# Altium schematic sheet Cell_121_sheet_3.SchDoc
size 420 x 297 mm; DocumentNumber: Фг3.089.121 Э3; SheetNumber: 3; SheetTotal: 4
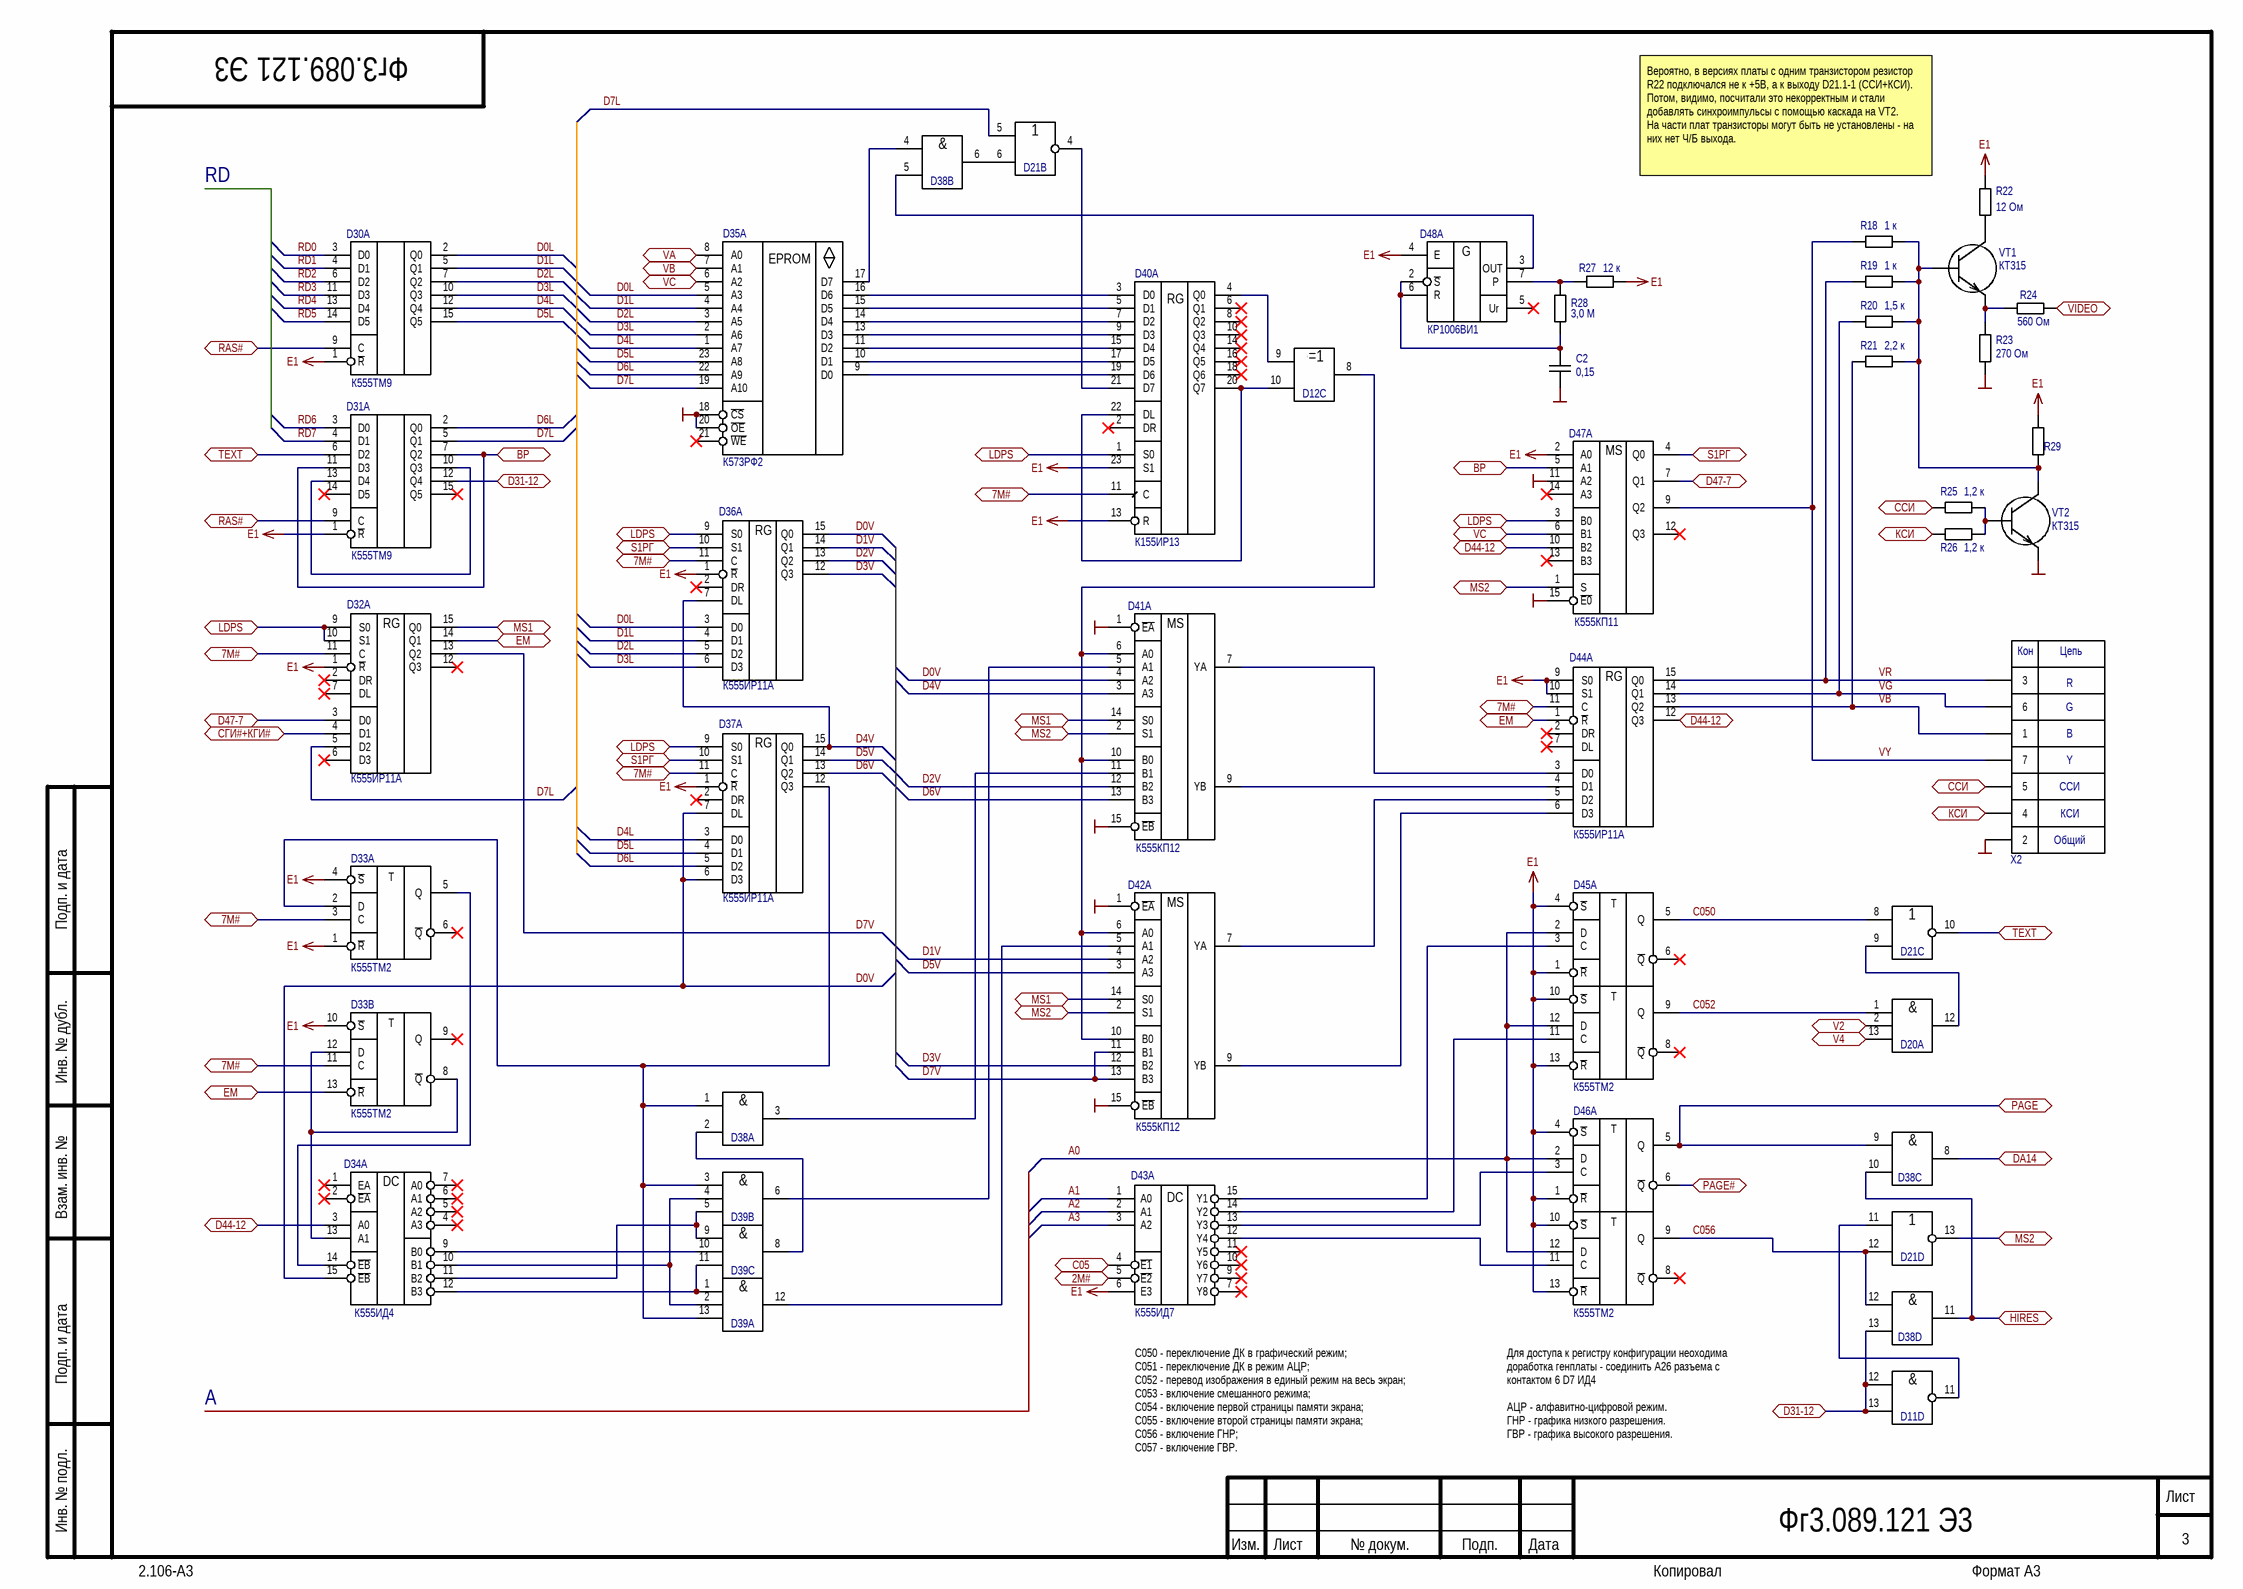
[diagram p0: Cell_121_sheet_3.SchDoc]

## Parts
C2  0,15  [C5]
D11  К555ЛА3  [201.14]  (value not drawn)  (part D of 5)
D12  К555ЛП5  [201.14]  (value not drawn)  (part C of 5)
D20  К555ЛИ3  [201.14]  (value not drawn)  (part A of 4)
D21  К555ЛЕ1  [201.14]  (value not drawn)  (parts B,C,D of 5)
D30  К555ТМ9  [201.16]  (part A of 2)
D31  К555ТМ9  [201.16]  (part A of 2)
D32  К555ИР11А  [201.16]  (part A of 2)
D33  К555ТМ2  [201.14]  (parts A,B of 3)
D34  К555ИД4  [201.16]  (part A of 2)
D35  К573РФ2  [2120.24 socket]  (part A of 2)
D36  К555ИР11А  [201.16]  (part A of 2)
D37  К555ИР11А  [201.16]  (part A of 2)
D38  К555ЛИ1  [201.14]  (value not drawn)  (parts A,B,C,D of 5)
D39  К555ЛИ3  [201.14]  (value not drawn)  (parts A,B,C of 4)
D40  К155ИР13  [2120.24]  (part A of 2)
D41  К555КП12  [201.16]  (part A of 2)
D42  К555КП12  [201.16]  (part A of 2)
D43  К555ИД7  [201.16]  (part A of 2)
D44  К555ИР11А  [201.16]  (part A of 2)
D45  К555ТМ2  [201.14]  (value not drawn)  (parts A,B of 3)
D46  К555ТМ2  [201.14]  (value not drawn)  (parts A,B of 3)
D47  К555КП11  [201.16]  (part A of 2)
D48  КР1006ВИ1  [2101.8]  (part A of 2)
R18  1 к  [R10]
R19  1 к  [R10]
R20  1,5 к  [R10]
R21  2,2 к  [R10]
R22  12 Ом  [R10]
R23  270 Ом  [R10]
R24  560 Ом  [R10]
R25  1,2 к  [R10]
R26  1,2 к  [R10]
R27  12 к  [R10]
R28  3,0 М  [R10]
R29  ???  [R10]  (value not drawn)
VT1  КТ315  [КТ315]
VT2  КТ315  [КТ315]
X2  RGB121  [RGB_VIDEO]  (value not drawn)  (no BOM)

## Ports
2M# (bidir, see Cell_121_sheet_1[2B]), 7M# (bidir, see Cell_121_sheet_1[2D], Cell_121_sheet_3[1B], Cell_121_sheet_3[1C], Cell_121_sheet_3[2B]), 7M# (bidir, see Cell_121_sheet_1[2D], Cell_121_sheet_3[1B], Cell_121_sheet_3[1C], Cell_121_sheet_3[2B], Cell_121_sheet_3[3B]), 7M# (bidir, see Cell_121_sheet_1[2D], Cell_121_sheet_3[1C], Cell_121_sheet_3[2B], Cell_121_sheet_3[3B]), BP (bidir, see Cell_121_sheet_3[1B]), BP (bidir, see Cell_121_sheet_3[3B]), C05 (bidir, see Cell_121_sheet_1[1B]), D31-12 (bidir, see Cell_121_sheet_3[1B]), D31-12 (bidir, see Cell_121_sheet_3[4D]), D44-12 (bidir, see Cell_121_sheet_3[1D], Cell_121_sheet_3[3B]), D44-12 (bidir, see Cell_121_sheet_3[1D], Cell_121_sheet_3[4B]), D44-12 (bidir, see Cell_121_sheet_3[3B], Cell_121_sheet_3[4B]), D47-7 (bidir, see Cell_121_sheet_3[1B]), D47-7 (bidir, see Cell_121_sheet_3[4B]), DA14 (bidir, see Cell_121_sheet_2[2C]), EM (bidir, see Cell_121_sheet_3[1B], Cell_121_sheet_3[1C]), EM (bidir, see Cell_121_sheet_3[1B], Cell_121_sheet_3[3B]), EM (bidir, see Cell_121_sheet_3[1C], Cell_121_sheet_3[3B]), HIRES (bidir, see Cell_121_sheet_1[4B]), LDPS (bidir, see Cell_121_sheet_1[2C], Cell_121_sheet_3[1B], Cell_121_sheet_3[2B]), LDPS (bidir, see Cell_121_sheet_1[2C], Cell_121_sheet_3[1B], Cell_121_sheet_3[2B], Cell_121_sheet_3[3B]), LDPS (bidir, see Cell_121_sheet_1[2C], Cell_121_sheet_3[2B], Cell_121_sheet_3[3B]), MS1 (bidir, see Cell_121_sheet_3[1B], Cell_121_sheet_3[2B]), MS1 (bidir, see Cell_121_sheet_3[1B], Cell_121_sheet_3[2C]), MS1 (bidir, see Cell_121_sheet_3[2B], Cell_121_sheet_3[2C]), MS2 (bidir, see Cell_121_sheet_3[2B], Cell_121_sheet_3[2C], Cell_121_sheet_3[3B]), MS2 (bidir, see Cell_121_sheet_3[2B], Cell_121_sheet_3[2C], Cell_121_sheet_3[4D]), MS2 (bidir, see Cell_121_sheet_3[2B], Cell_121_sheet_3[3B], Cell_121_sheet_3[4D]), MS2 (bidir, see Cell_121_sheet_3[2C], Cell_121_sheet_3[3B], Cell_121_sheet_3[4D]), PAGE (bidir, see Cell_121_sheet_1[4B]), PAGE# (bidir, see Cell_121_sheet_1[4B]), RAS# (bidir, see Cell_121_sheet_1[2B], Cell_121_sheet_2[3B], Cell_121_sheet_2[3C], Cell_121_sheet_3[1A]), RAS# (bidir, see Cell_121_sheet_1[2B], Cell_121_sheet_2[3B], Cell_121_sheet_2[3C], Cell_121_sheet_3[1B]), S1РГ (bidir, see Cell_121_sheet_3[2B]), S1РГ (bidir, see Cell_121_sheet_3[2B], Cell_121_sheet_3[4B]), TEXT (bidir, see Cell_121_sheet_3[1B]), TEXT (bidir, see Cell_121_sheet_3[4C]), V2 (bidir, see Cell_121_sheet_1[3B], Cell_121_sheet_1[3C], Cell_121_sheet_2[2C]), V4 (bidir, see Cell_121_sheet_1[3C], Cell_121_sheet_1[4A]), VA (bidir, see Cell_121_sheet_1[3A], Cell_121_sheet_1[4B]), VB (bidir, see Cell_121_sheet_1[3B], Cell_121_sheet_1[4B]), VC (bidir, see Cell_121_sheet_1[3B], Cell_121_sheet_1[3C], Cell_121_sheet_1[4B], Cell_121_sheet_3[2A]), VC (bidir, see Cell_121_sheet_1[3B], Cell_121_sheet_1[3C], Cell_121_sheet_1[4B], Cell_121_sheet_3[3B]), VIDEO (bidir, see Cell_121_sheet_1[1C]), КСИ (bidir, see Cell_121_sheet_1[4C], Cell_121_sheet_3[4B]), КСИ (bidir, see Cell_121_sheet_1[4C], Cell_121_sheet_3[4C]), СГИ#+КГИ# (bidir, see Cell_121_sheet_1[4C]), ССИ (bidir, see Cell_121_sheet_1[4C], Cell_121_sheet_3[4B])

## Nets
E1: D30.1(~{R}) D31.1(~{R}) D32.1(~{R}) D33.1(~{R}) D33.4(~{S}) D33.10(~{S}) D36.1(~{R}) D37.1(~{R}) D40.13(R) D40.23(S1) D43.6(E3) D44.9(S0) D44.10(S1) D45.1(~{R}) D45.4(~{S}) D45.10(~{S}) D45.13(~{R}) D46.1(~{R}) D46.4(~{S}) D46.10(~{S}) D46.13(~{R}) D47.2(A0) D48.4(E) R22.2 R27.2 R29.2
GND: C2.2 D35.18(~{CS}) D35.20(~{OE}) D41.1(~{EA}) D41.15(~{EB}) D42.1(~{EA}) D42.15(~{EB}) D47.11(A2) D47.15(~{E0}) R23.1 VT2.E X2.2
2M#: D43.5(~{E2}) ; port 2M#
7M#: D32.11(C) D33.3(C) D33.11(C) D36.11(C) D37.11(C) D40.11(C) D44.11(C) ; port 7M#
A0: D45.2(D) D45.12(D) D46.2(D) D46.12(D)
A1: D43.1(A0)
A2: D43.2(A1)
A3: D43.3(A2)
BP: D31.7(Q2) D31.11(D3) D47.5(A1) ; port BP
C05: D43.4(~{E1}) ; port C05
C050: D21.8(A) D45.5(Q)
C052: D20.1(A) D45.9(Q)
C056: D21.12(B) D38.12(A) D46.9(Q)
D0L: D30.2(Q0) D35.5(A3) D36.3(D0)
D0V: D34.15(~{EB}) D36.15(Q0) D37.6(D3) D37.7(DL) D41.4(A2)
D1L: D30.5(Q1) D35.4(A4) D36.4(D1)
D1V: D36.14(Q1) D42.4(A2)
D2L: D30.7(Q2) D35.3(A5) D36.5(D2)
D2V: D36.13(Q2) D41.12(B2)
D3L: D30.10(Q3) D35.2(A6) D36.6(D3)
D3V: D36.12(Q3) D42.12(B2)
D4L: D30.12(Q4) D35.1(A7) D37.3(D0)
D4V: D36.7(DL) D37.15(Q0) D41.3(A3)
D5L: D30.15(Q5) D35.23(A8) D37.4(D1)
D5V: D37.14(Q1) D42.3(A3)
D6L: D31.2(Q0) D35.22(A9) D37.5(D2)
D6V: D37.13(Q2) D41.13(B3)
D7L: D21.5(A) D31.5(Q1) D32.5(D2) D35.19(A10)
D7V: D32.13(Q2) D42.11(B1) D42.13(B3)
D31-12: D11.12(A) D11.13(B) D31.12(Q4) D38.13(B) ; port D31-12
D44-12: D34.3(A0) D44.12(Q3) D47.10(B2) ; port D44-12
D47-7: D32.3(D0) D47.7(Q1) ; port D47-7
DA14: D38.8(O) ; port DA14
EM: D32.14(Q1) D33.13(~{R}) D44.1(~{R}) ; port EM
HIRES: D38.10(B) D38.11(O) ; port HIRES
LDPS: D32.9(S0) D32.10(S1) D36.9(S0) D37.9(S0) D40.1(S0) D47.3(B0) ; port LDPS
MS1: D32.15(Q0) D41.14(S0) D42.14(S0) ; port MS1
MS2: D21.13(~{O}) D41.2(S1) D42.2(S1) D47.1(S) ; port MS2
PAGE: D38.9(A) D46.5(Q) ; port PAGE
PAGE#: D46.6(~{Q}) ; port PAGE#
RAS#: D30.9(C) D31.9(C) ; port RAS#
RD0: D30.3(D0)
RD1: D30.4(D1)
RD2: D30.6(D2)
RD3: D30.11(D3)
RD4: D30.13(D4)
RD5: D30.14(D5)
RD6: D31.3(D0)
RD7: D31.4(D1)
S1РГ: D36.10(S1) D37.10(S1) D47.4(Q0) ; port S1РГ
TEXT: D21.10(~{O}) D31.6(D2) ; port TEXT
V2: D20.2(B) ; port V2
V4: D20.13(C) ; port V4
VA: D35.8(A0) ; port VA
VB: D35.7(A1) ; port VB
VB: D44.13(Q2) R21.1 X2.1  [a separate net that carries the same name]
VC: D35.6(A2) D47.6(B1) ; port VC
VG: D44.14(Q1) R20.2 X2.6
VIDEO: R24.1 ; port VIDEO
VR: D44.15(Q0) R19.2 X2.3
VY: D47.9(Q2) R18.1 X2.7
КСИ: R26.1 X2.4 ; port КСИ
СГИ#+КГИ#: D32.4(D1) ; port СГИ#+КГИ#
ССИ: R25.1 X2.5 ; port ССИ
NetC2_1: C2.1 D48.2(~{S}) D48.6(R) R28.2
NetD11_11: D11.11(~{O}) D21.11(A)
NetD12_8: D12.8(O) D41.6(A0) D41.10(B0) D42.6(A0) D42.10(B0)
NetD12_9: D12.9(B) D40.4(Q0)
NetD12_10: D12.10(A) D40.20(Q7) D40.22(DL)
NetD20_12: D20.12(~{O}) D21.9(B)
NetD21_4: D21.4(~{O}) D40.21(D7)
NetD21_6: D21.6(B) D38.6(O)
NetD31_10: D31.10(Q3) D31.13(D4)
NetD33_2: D33.2(D) D37.12(Q3) D38.1(A) D39.3(A) D39.13(C)
NetD33_5: D33.5(Q) D34.14(~{EB})
NetD33_8: D33.8(~{Q}) D33.12(D) D34.13(A1)
NetD34_9: D34.9(B0) D39.10(B)
NetD34_10: D34.10(B1) D39.2(B) D39.4(B)
NetD34_11: D34.11(B2) D39.5(C) D39.9(A)
NetD34_12: D34.12(B3) D39.1(A) D39.11(C)
NetD35_9: D35.9(D0) D40.19(D6)
NetD35_10: D35.10(D1) D40.17(D5)
NetD35_11: D35.11(D2) D40.15(D4)
NetD35_13: D35.13(D3) D40.9(D3)
NetD35_14: D35.14(D4) D40.7(D2)
NetD35_15: D35.15(D5) D40.5(D1)
NetD35_16: D35.16(D6) D40.3(D0)
NetD35_17: D35.17(D7) D38.4(A)
NetD38_2: D38.2(B) D39.8(~{O})
NetD38_3: D38.3(O) D41.11(B1)
NetD38_5: D38.5(B) D48.3(OUT)
NetD39_6: D39.6(~{O}) D41.5(A1)
NetD39_12: D39.12(~{O}) D42.5(A1)
NetD41_7: D41.7(YA) D44.3(D0)
NetD41_9: D41.9(YB) D44.4(D1)
NetD42_7: D42.7(YA) D44.5(D2)
NetD42_9: D42.9(YB) D44.6(D3)
NetD43_12: D43.12(Y4) D46.11(C)
NetD43_13: D43.13(Y3) D46.3(C)
NetD43_14: D43.14(Y2) D45.11(C)
NetD43_15: D43.15(Y1) D45.3(C)
NetD48_7: D48.7(P) R27.1 R28.1
NetR18_2: R18.2 R19.1 R20.1 R21.2 R29.1 VT1.B VT2.C
NetR22_1: R22.1 VT1.C
NetR23_2: R23.2 R24.2 VT1.E
NetR25_2: R25.2 R26.2 VT2.B

Not connected (* = marked no-connect by the designer): D31 14(D5)* 15(Q5)*; D32 2(DR)* 6(D3)* 7(DL)* 12(Q3)*; D33 6(~{Q})* 9(Q)*; D34 1(EA)* 2(~{EA})* 4(A3)* 5(A2)* 6(A1)* 7(A0)*; D35 21(~{WE})*; D36 2(DR)*; D37 2(DR)*; D40 2(DR)* 6(Q1)* 8(Q2)* 10(Q3)* 14(Q4)* 16(Q5)* 18(Q6)*; D43 7(Y8)* 9(Y7)* 10(Y6)* 11(Y5)*; D44 2(DR)* 7(DL)*; D45 6(~{Q})* 8(~{Q})*; D46 8(~{Q})*; D47 12(Q3)* 13(B3)* 14(A3)*; D48 5(Ur)*

## Notes on the sheet
- RD
- Вероятно, в версиях платы с одним транзистором резистор R22 подключался не к +5В, а к выходу D21.1-1 (ССИ+КСИ).
  Потом, видимо, посчитали это некорректным и стали добавлять синхроимпульсы с помощью каскада на VT2.
  На части плат транзисторы могут быть не установлены - на них нет Ч/Б выхода.
- A
- (near D43) C050 - переключение ДК в графический режим;
  C051 - переключение ДК в режим АЦР;
  C052 - перевод изображения в единый режим на весь экран;
  C053 - включение смешанного режима;
  C054 - включение первой страницы памяти экрана;
  C055 - включение второй страницы памяти экрана;
  C056 - включение ГНР;
  C057 - включение ГВР.
- (near D46) Для доступа к регистру конфигурации неоходима доработка генплаты - соединить А26 разъема с контактом 6 D7 ИД4
  АЦР - алфавитно-цифровой режим.
  ГНР - графика низкого разрешения.
  ГВР - графика высокого разрешения.
- Подп. и дата
- Инв. № дубл.
- Взам. инв. №
- Инв. № подл.
- Изм.
- Лист
- № докум.
- Подп.
- Дата
- 2.106-A3
- Копировал
- Формат А3
- (in symbol RGB121) Кон; Цепь; R; G; B; Y; ССИ; КСИ; Общий
- (in symbol К155ИР13, part A) RG
- (in symbol К555ИД4, part A) DC
- (in symbol К555ИД7, part A) DC
- (in symbol К555ИР11А, part A) RG
- (in symbol К555КП11, part A) MS
- (in symbol К555КП12, part A) MS
- (in symbol К555ЛА3, part D) &
- (in symbol К555ЛИ1, part A) &
- (in symbol К555ЛИ1, part B) &
- (in symbol К555ЛИ1, part C) &
- (in symbol К555ЛИ1, part D) &
- (in symbol К555ЛИ3, part A) &
- (in symbol К555ЛИ3, part B) &
- (in symbol К555ЛИ3, part C) &
- (in symbol К555ЛП5, part C) ·=1; ·
- (in symbol К555ТМ2, part A) T
- (in symbol К555ТМ2, part B) T
- (in symbol К573РФ2, part A) EPROM
- (in symbol КР1006ВИ1, part A) G

## Library data of the parts
C2 = К10-17: Value: 0,15
D12 = К555ЛП5: ManufacturerPartNumber: К155ЛП5
D20 D39 = К555ЛИ3: ManufacturerPartNumber: К555ЛА3
D21 = К555ЛЕ1: ManufacturerPartNumber: К555ЛА3
D30 D31 = К555ТМ9: ManufacturerPartNumber: SN74ALS174
D32 D36 D37 D44 = К555ИР11А: ManufacturerPartNumber: КР531ИЕ17
D41 D42 = К555КП12: ManufacturerPartNumber: К155КП2
D43 = К555ИД7: ManufacturerPartNumber: SN74ALS138
D48 = КР1006ВИ1: ManufacturerPartNumber: К555ИД4
R18-R29 = С2-23: Резистор
  R18 R19: Value: 1 к
  R20: Value: 1,5 к
  R21: Value: 2,2 к
  R22: Value: 12 Ом
  R23: Value: 270 Ом
  R24: Value: 560 Ом
  R25 R26: Value: 1,2 к
  R27: Value: 12 к
  R28: Value: 3,0 М
  R29: Value: ???
D11 = К555ЛА3: ManufacturerPartNumber: К555ЛА3
D34 = К555ИД4: ManufacturerPartNumber: К555ИД4
D38 = К555ЛИ1: ManufacturerPartNumber: К555ЛИ1
D47 = К555КП11: ManufacturerPartNumber: К555КП11